# Altium project Lab8.PrjPCB
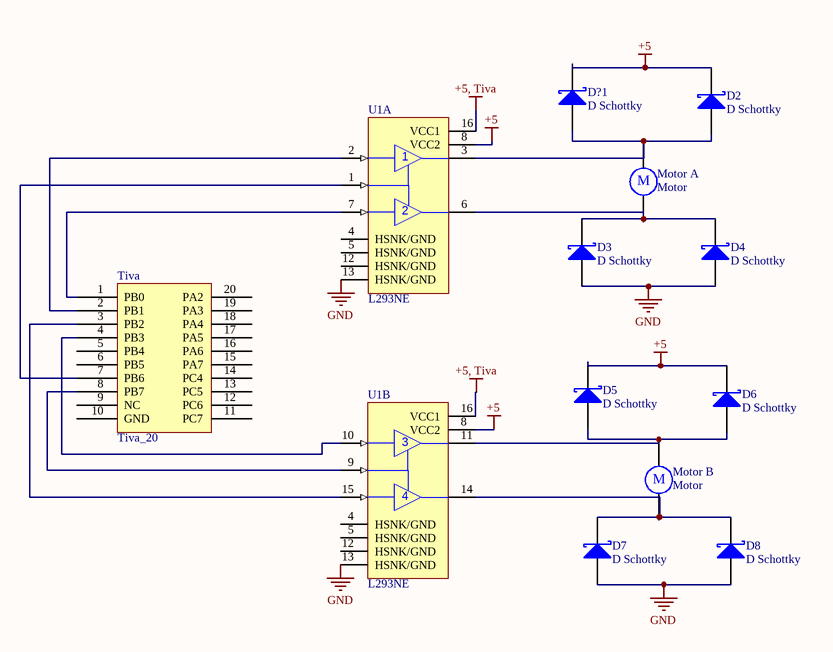
[diagram p0: MotorSchematic.SchDoc]
5 sheets, 31 parts. Net scope: global (net labels, ports and power ports of the same name join across sheets).
Sheets:
  MotorSchematic.SchDoc
  Command Generator.SchDoc
  IR Detection.SchDoc
  Tape Detection.SchDoc
  TIVA Pin Out.SchDoc

## Sheet MotorSchematic.SchDoc
size A; Organization: Smart Product Design Lab; Address1: 201 Thornton; Address2: Stanford University; Address3: Stanford, CA; Address4: 94305-4021

### Parts
(Parts that share a designator on the sheet are numbered #1, #2 ... from top to bottom, then left to right.)
D2  D Schottky  [DSO-C2/X2.3]
D3  D Schottky  [DSO-C2/X2.3]
D4  D Schottky  [DSO-C2/X2.3]
D5  D Schottky  [DSO-C2/X2.3]
D6  D Schottky  [DSO-C2/X2.3]
D7  D Schottky  [DSO-C2/X2.3]
D8  D Schottky  [DSO-C2/X2.3]
D?1  D Schottky  [DSO-C2/X2.3]
Motor_A  Motor  [RB5-10.5]
Motor_B  Motor  [RB5-10.5]
Tiva#1  Tiva_20
U1  L293NE  [DIP-16/X1.5]  (parts A,B of 2)

### Nets
+5: D2.2(K) D5.2(K) D6.2(K) D?1.2(K) U1.8(VCC2)
+5, Tiva: U1.16(VCC1)
GND: D3.1(A) D4.1(A) D7.1(A) D8.1(A) U1.13(HSNK/GND)
NetD2_1: D2.1(A) D?1.1(A) Motor_A.1 U1.3(1Y)
NetD3_2: D3.2(K) D4.2(K) Motor_A.2 U1.6(2Y)
NetD5_1: D5.1(A) D6.1(A) Motor_B.1 U1.11(3Y)
NetD7_2: D7.2(K) D8.2(K) Motor_B.2 U1.14(4Y)
NetTiva#1_1: Tiva#1.1(PB0) U1.7(2A)
NetTiva#1_2: Tiva#1.2(PB1) U1.2(1A)
NetTiva#1_3: Tiva#1.3(PB2) U1.15(4A)
NetTiva#1_4: Tiva#1.4(PB3) U1.10(3A)
NetTiva#1_7: Tiva#1.7(PB6) U1.1(1,2EN)
NetTiva#1_8: Tiva#1.8(PB7) U1.9(3,4EN)

Not connected (* = marked no-connect by the designer): Tiva#1 5(PB4) 6(PB5) 9(NC) 10(GND) 11(PC7) 12(PC6) 13(PC5) 14(PC4) 15(PA7) 16(PA6) 17(PA5) 18(PA4) 19(PA3) 20(PA2); U1 4(HSNK/GND) 5(HSNK/GND) 12(HSNK/GND)

### Notes on the sheet
- Title
- Size:
- Date:
- File:
- A
- Number:
- Time:
- Revision:
- Sheet
- of
- Drawn By:
- (in symbol Motor) M

### Library data of the parts
D2-D8 D?1 = D Schottky: Schottky Diode; Manufacturer: Generic Components; Class: Discrete; SubClass: Diode - Schottky; Published: 08/06/2000; Publisher: Altium Hobart Technology Centre
Motor_A Motor_B = Motor: Motor, General Kind; Manufacturer: Generic Components; Published: 1999
Tiva#1 = Tiva_20: Tiva Protection 20 Pin Connector
U1 = L293NE: Quadruple Half-H Driver; Manufacturer: Texas Instruments; Class: Interface; SubClass: Peripheral Driver; Published: 15/05/2002; Publisher: Altium Hobart Technology Centre

## Sheet Command Generator.SchDoc
size A; Organization: Smart Product Design Lab; Address1: 201 Thornton; Address2: Stanford University; Address3: Stanford, CA; Address4: 94305-4021
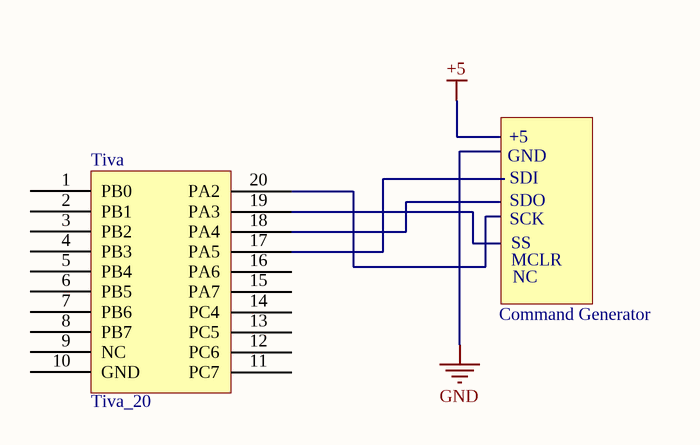
[diagram p1: Command Generator.SchDoc]

### Parts
(Parts that share a designator on the sheet are numbered #1, #2 ... from top to bottom, then left to right.)
Tiva#2  Tiva_20

### Nets

Not connected (* = marked no-connect by the designer): Tiva#2 1(PB0) 2(PB1) 3(PB2) 4(PB3) 5(PB4) 6(PB5) 7(PB6) 8(PB7) 9(NC) 10(GND) 11(PC7) 12(PC6) 13(PC5) 14(PC4) 15(PA7) 16(PA6) 17(PA5) 18(PA4) 19(PA3) 20(PA2)

### Notes on the sheet
- GND
- +5
- SDI
- SDO
- SCK
- MCLR
- SS
- NC
- Command Generator
- Title
- Size:
- Date:
- File:
- A
- Number:
- Time:
- Revision:
- Sheet
- of
- Drawn By:

### Library data of the parts
Tiva#2 = Tiva_20: Tiva Protection 20 Pin Connector

## Sheet IR Detection.SchDoc
size A
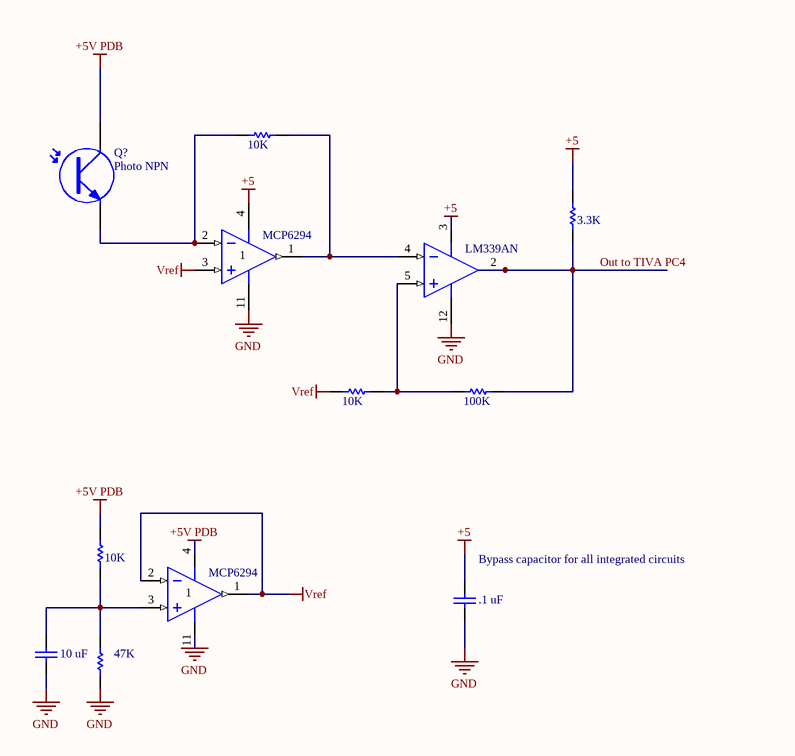
[diagram p2: IR Detection.SchDoc]

### Parts
(Parts that share a designator on the sheet are numbered #1, #2 ... from top to bottom, then left to right.)
C?#1  .1 uF  [RAD-0.3]
C?#2  10 uF  [RAD-0.3]
Q?  Photo NPN  [SFM-T2(3)/X1.6V]
R?#1  10K  [AXIAL-0.3]
R?#2  3.3K  [AXIAL-0.3]
R?#3  10K  [AXIAL-0.3]
R?#4  100K  [AXIAL-0.3]
R?#5  10K  [AXIAL-0.3]
R?#6  47K  [AXIAL-0.3]
U?#1  MCP6294  [DIP-14/D19.7]  (part A of 4)
U?#2  LM339AN  [DIP-14/D19.7]  (part A of 4)
U?#3  MCP6294  [DIP-14/D19.7]  (part A of 4)

### Nets
+5: C?#1.2 R?#2.1 U?#1.4(V+) U?#2.3(V+)
+5V PDB: Q?.1(C) R?#5.1 U?#3.4(V+)
GND: C?#1.1 C?#2.1 R?#6.2 U?#1.11(V-) U?#2.12(GND) U?#3.11(V-)
Vref: R?#3.2 U?#1.3(IN+) U?#3.1(OUT) U?#3.2(IN-)
Out to TIVA PC4: R?#2.2 R?#4.1 U?#2.2(OUT)
NetC?#2_2: C?#2.2 R?#5.2 R?#6.1 U?#3.3(IN+)
NetQ?_3: Q?.3(E) R?#1.1 U?#1.2(IN-)
NetR?#1_2: R?#1.2 U?#1.1(OUT) U?#2.4(IN-)
NetR?#3_1: R?#3.1 R?#4.2 U?#2.5(IN+)

### Notes on the sheet
- (near C?#1) Bypass capacitor for all integrated circuits

### Library data of the parts
C?#1 C?#2 = Cap: Capacitor; Manufacturer: Generic Components; Class: Passive; Value: 100pF; Published: 08/06/2000; Publisher: Altium Hobart Technology Centre; SubClass: Capacitor
Q? = Photo NPN: NPN Phototransistor; Manufacturer: Generic Components; Class: Optoelectronic; Published: 1999
R?#1 = Res1: Resistor; Manufacturer: Generic Components; Class: Passive; Published: 08/06/2000; Publisher: Altium Hobart Technology Centre; SubClass: Resistor
R?#2-R?#6 = Res1: Resistor; Manufacturer: Generic Components; Class: Passive; Value: 1K; Published: 08/06/2000; Publisher: Altium Hobart Technology Centre; SubClass: Resistor
U?#1 U?#3 = MCP6294: Quad 1Ma 10MHz Rail-to-Rail I/O Operational Amplifier; Manufacturer: National Semiconductor; Published: 15/04/2002; Publisher: Altium Hobart Technology Centre; Class: Amplifier; SubClass: Operational Amplifier
U?#2 = LM339AN: Quad Single-Supply Comparator; Manufacturer: Motorola; Class: Analog; Published: 15/04/2002; Publisher: Altium Hobart Technology Centre; SubClass: Comparator

## Sheet Tape Detection.SchDoc
size A
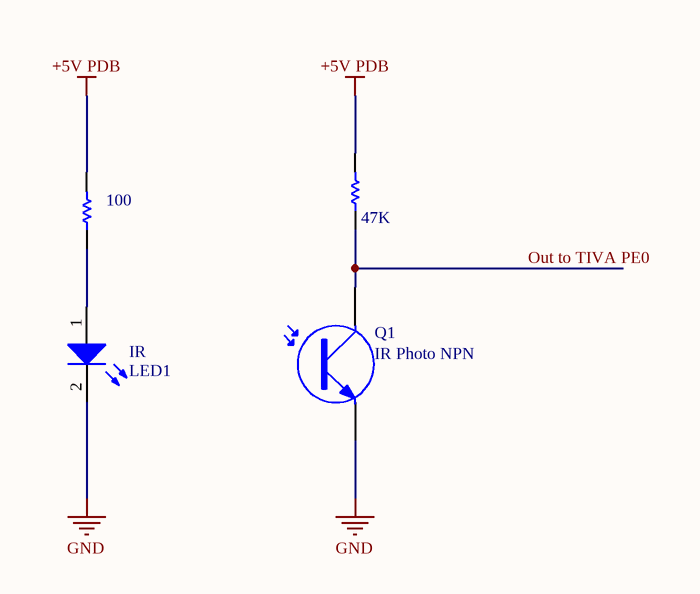
[diagram p3: Tape Detection.SchDoc]

### Parts
(Parts that share a designator on the sheet are numbered #1, #2 ... from top to bottom, then left to right.)
IR  LED1  [LED-0]
Q1  IR Photo NPN  [SFM-T2(3)/X1.6V]
R?#7  value 47K  [AXIAL-0.3]  (hidden comment: Res1)
R?#8  value 100  [AXIAL-0.3]  (hidden comment: Res1)

### Nets
+5V PDB: R?#7.2 R?#8.2
GND: IR.2(K) Q1.3(E)
Out to TIVA PE0: Q1.1(C) R?#7.1
NetIR_1: IR.1(A) R?#8.1

### Library data of the parts
IR = LED0: Typical INFRARED GaAs LED; Manufacturer: Generic Components; Class: Optoelectronic; Published: 08/06/2000; Publisher: Altium Hobart Technology Centre; SubClass: LED
Q1 = Photo NPN: as Q? on sheet IR Detection; Published: 1999
R?#7 R?#8 = Res1: as R?#1 on sheet IR Detection; Published: 08/06/2000; Publisher: Altium Hobart Technology Centre; SubClass: Resistor

## Sheet TIVA Pin Out.SchDoc
size A
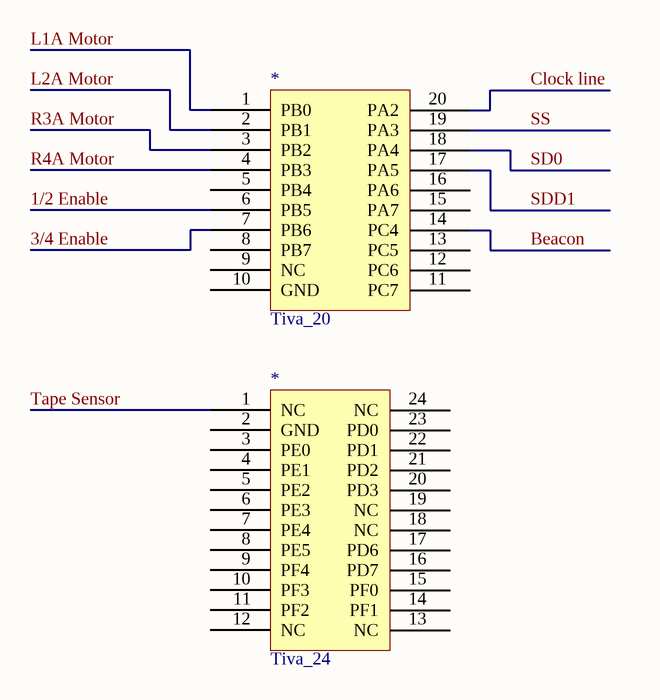
[diagram p4: TIVA Pin Out.SchDoc]

### Parts
(Parts that share a designator on the sheet are numbered #1, #2 ... from top to bottom, then left to right.)
*#1  Tiva_20
*#2  Tiva_24

### Nets
1/2 Enable: *#1.6(PB5)
3/4 Enable: *#1.7(PB6)
Beacon: *#1.14(PC4)
Clock line: *#1.20(PA2)
L1A Motor: *#1.1(PB0)
L2A Motor: *#1.2(PB1)
R3A Motor: *#1.3(PB2)
R4A Motor: *#1.4(PB3)
SD0: *#1.18(PA4)
SDD1: *#1.17(PA5)
SS: *#1.19(PA3)
Tape Sensor: *#2.1(NC)

Not connected (* = marked no-connect by the designer): *#1 5(PB4) 8(PB7) 9(NC) 10(GND) 11(PC7) 12(PC6) 13(PC5) 15(PA7) 16(PA6); *#2 2(GND) 3(PE0) 4(PE1) 5(PE2) 6(PE3) 7(PE4) 8(PE5) 9(PF4) 10(PF3) 11(PF2) 12(NC) 13(NC) 14(PF1) 15(PF0) 16(PD7) 17(PD6) 18(NC) 19(NC) 20(PD3) 21(PD2) 22(PD1) 23(PD0) 24(NC)

### Library data of the parts
*#1 = Tiva_20: Tiva Protection 20 Pin Connector
*#2 = Tiva_24: Tiva Protection 24 Pin Connector

## Nets that join several sheets
+5: MotorSchematic (5 pins), IR Detection (C?#1.2 R?#2.1 U?#1.4 U?#2.3)
+5V PDB: IR Detection (Q?.1 R?#5.1 U?#3.4), Tape Detection (R?#7.2 R?#8.2)
GND: MotorSchematic (5 pins), IR Detection (6 pins), Tape Detection (IR.2 Q1.3)